# Altium schematic sheet bat_v.SchDoc
size A4
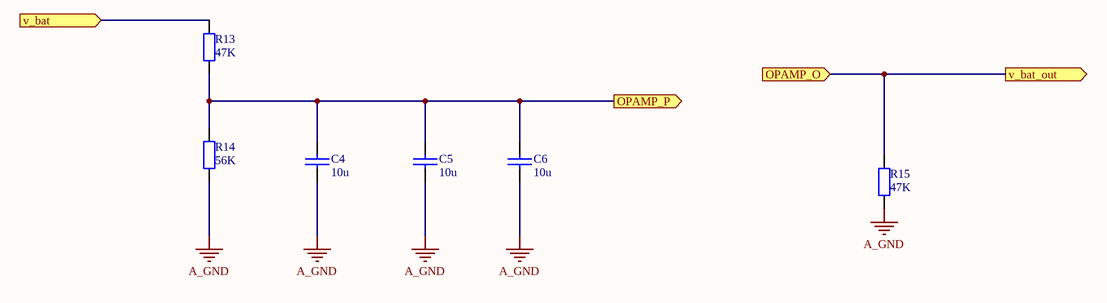
[diagram p0: bat_v.SchDoc]

## Parts
C4  10u
C5  10u
C6  10u
R13  47K
R14  56K
R15  47K

## Ports
OPAMP_O (in), OPAMP_P (out), v_bat (in), v_bat_out (out)

## Nets
A_GND: C4.1 C5.1 C6.1 R14.1 R15.1
OPAMP_O: R15.2 ; port v_bat_out, port OPAMP_O
OPAMP_P: C4.2 C5.2 C6.2 R13.1 R14.2 ; port OPAMP_P
v_bat: R13.2 ; port v_bat

## Library data of the parts
C4-C6 = Cap: Capacitor; Value: *
R13-R15 = Resistor: Value: *